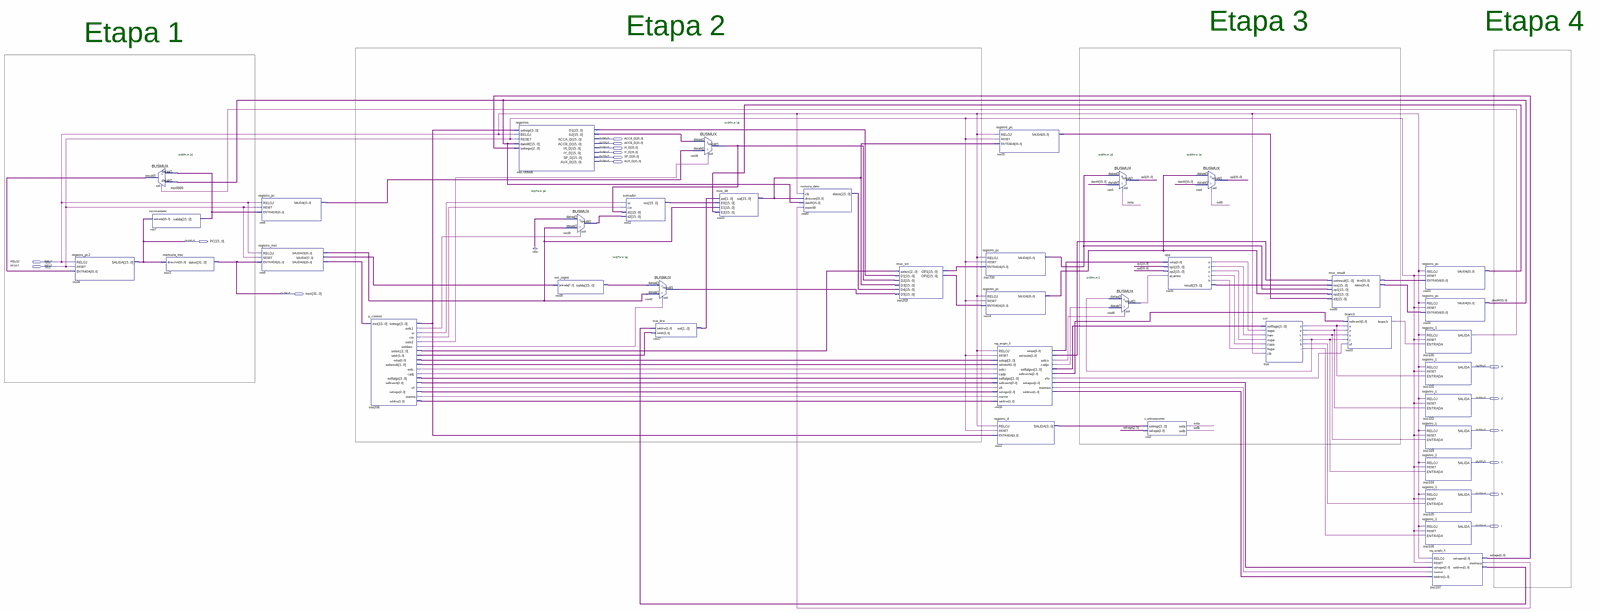
[diagram p0: schematic sheet, whole]
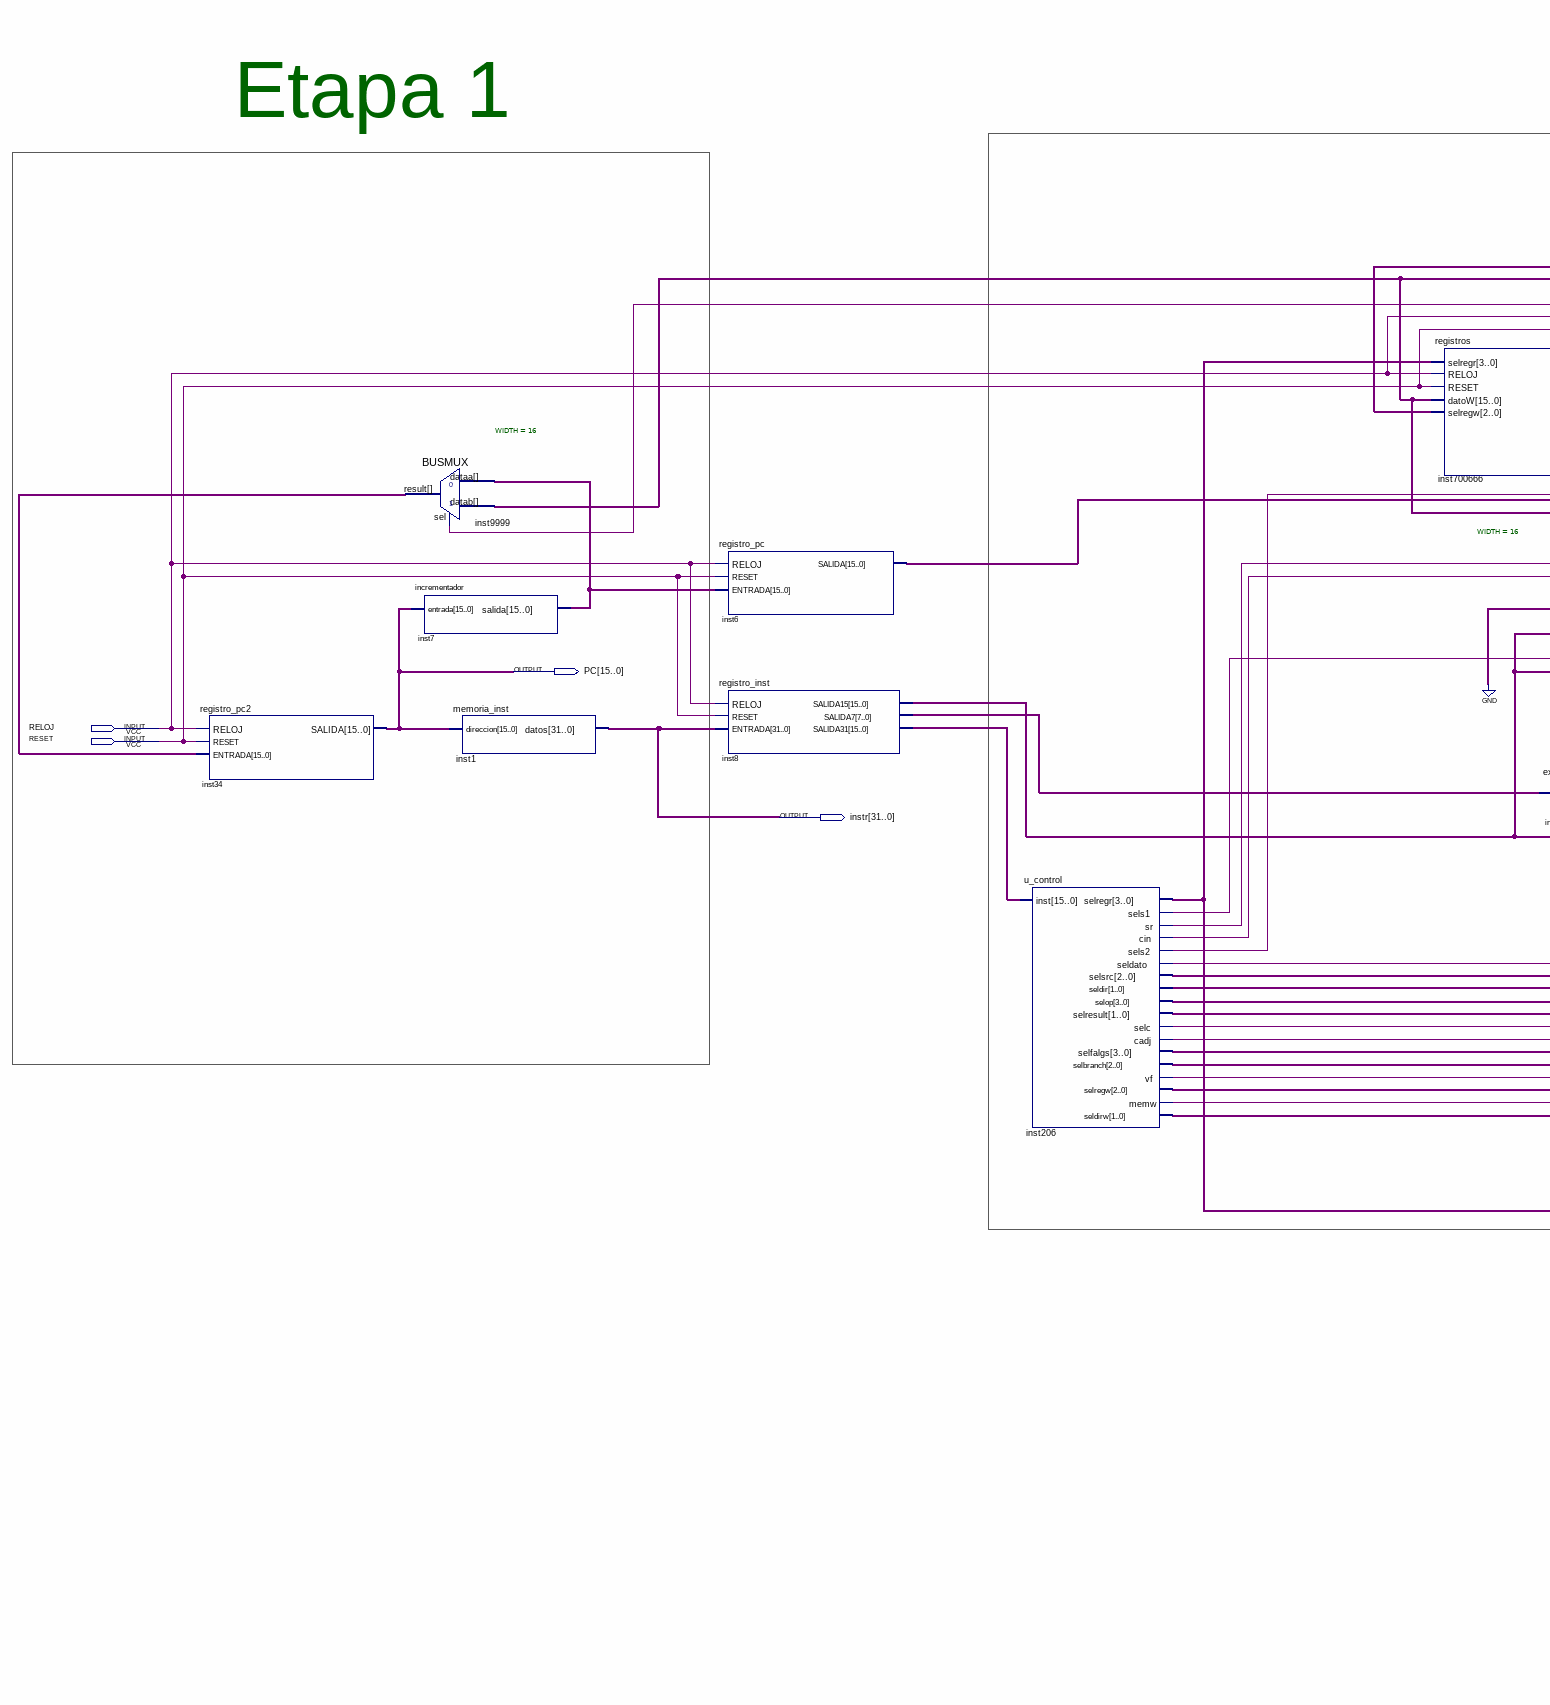
[diagram p1: schematic sheet, left part]
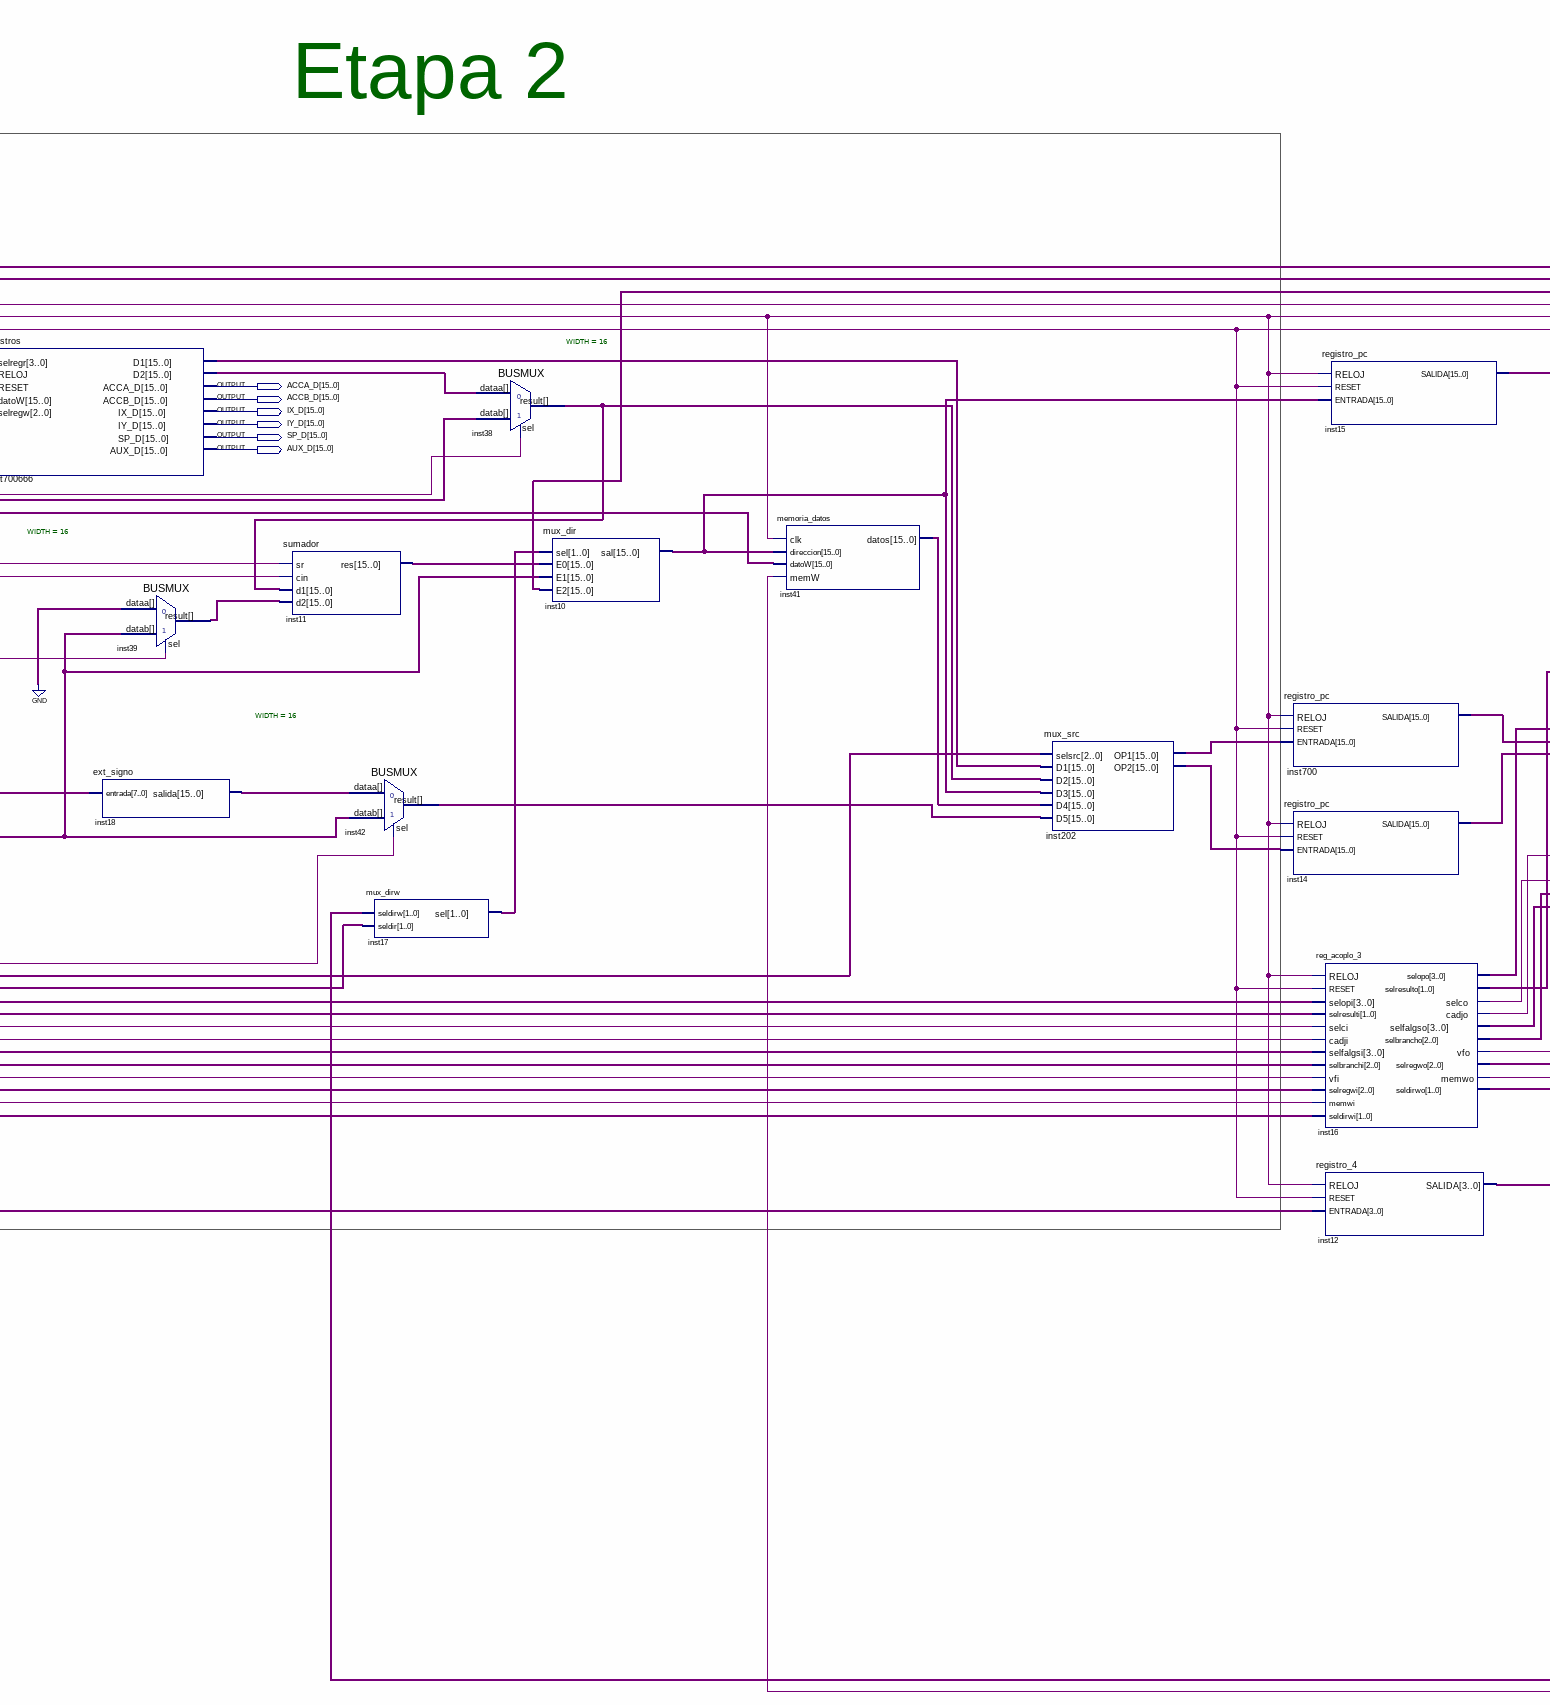
[diagram p2: schematic sheet, centre part]
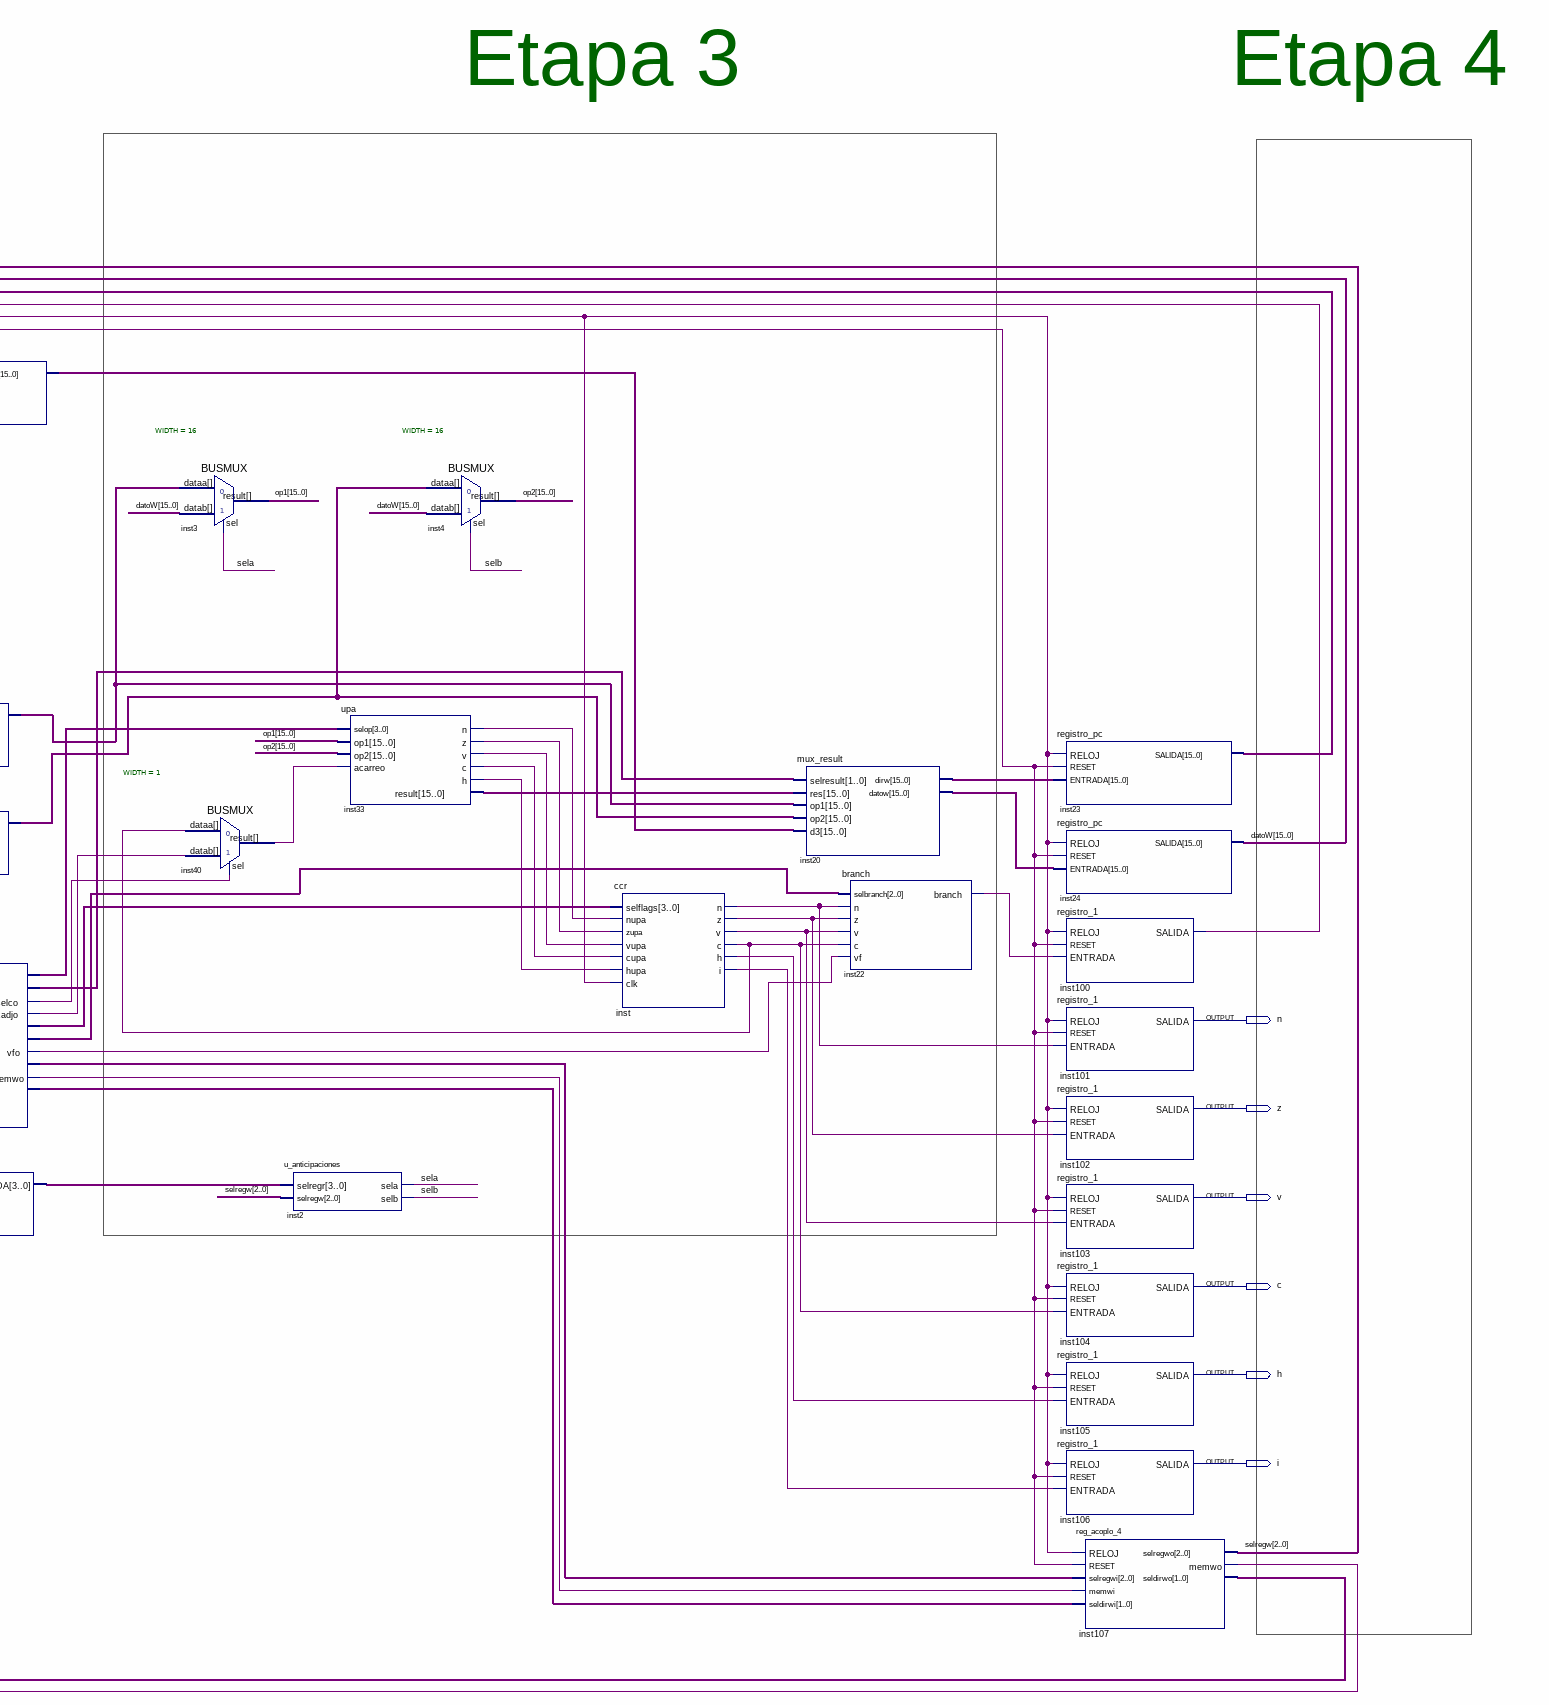
[diagram p3: schematic sheet, right part]
// Quartus schematic pipeline.bdf as structural Verilog: 40 symbols, 16 pins
module pipeline (
  input  RELOJ,
  input  RESET,
  output [15:0] ACCA_D,
  output [15:0] ACCB_D,
  output [15:0] IX_D,
  output [15:0] IY_D,
  output [15:0] SP_D,
  output [15:0] AUX_D,
  output [15:0] PC,
  output [31:0] instr,
  output n,
  output z,
  output v,
  output c,
  output h,
  output i
);

  wire inst16_cadjo, inst16_memwo, inst16_selco, inst16_vfo, inst22_branch, inst33_c, inst33_h, inst33_n,
       inst33_v, inst33_z, inst40_result, inst100_salida, inst107_memwo, inst206_cadj, inst206_cin,
       inst206_memw, inst206_selc, inst206_seldato, inst206_sels1, inst206_sels2, inst206_sr, inst206_vf,
       inst_c, inst_h, inst_i, inst_n, inst_v, inst_z, sela, selb;
  wire [1:0] inst16_seldirwo, inst16_selresulto, inst17_sel, inst107_seldirwo, inst206_seldir,
       inst206_seldirw, inst206_selresult;
  wire [2:0] inst16_selbrancho, inst16_selregwo, inst206_selbranch, inst206_selregw, inst206_selsrc, selregw;
  wire [3:0] inst12_salida, inst16_selfalgso, inst16_selopo, inst206_selfalgs, inst206_selop, inst206_selregr;
  wire [7:0] inst8_salida7;
  wire [15:0] datoW, inst6_salida, inst7_salida, inst8_salida15, inst8_salida31, inst10_sal, inst11_res,
       inst14_salida, inst15_salida, inst18_salida, inst20_datow, inst20_dirw, inst23_salida, inst33_result,
       inst38_result, inst39_result, inst41_datos, inst42_result, inst202_op1, inst202_op2, inst700_salida,
       inst9999_result, inst700666_d1, inst700666_d2, op1, op2;

  registro_pc2 inst34 (.RELOJ(RELOJ), .RESET(RESET), .ENTRADA(inst9999_result), .SALIDA(PC));
  BUSMUX #(.WIDTH(16)) inst9999 (.datab(datoW), .sel(inst100_salida), .dataa(inst7_salida), .result(inst9999_result));
  incrementador inst7 (.entrada(PC), .salida(inst7_salida));
  memoria_inst inst1 (.direccion(PC), .datos(instr));
  registro_pc inst6 (.RELOJ(RELOJ), .RESET(RESET), .ENTRADA(inst7_salida), .SALIDA(inst6_salida));
  registro_inst inst8 (
    .RELOJ(RELOJ), .RESET(RESET), .ENTRADA(instr), .SALIDA15(inst8_salida15), .SALIDA7(inst8_salida7),
    .SALIDA31(inst8_salida31));
  u_control inst206 (
    .inst(inst8_salida31), .selregr(inst206_selregr), .sels1(inst206_sels1), .sr(inst206_sr),
    .cin(inst206_cin), .sels2(inst206_sels2), .seldato(inst206_seldato), .selsrc(inst206_selsrc),
    .seldir(inst206_seldir), .selop(inst206_selop), .selresult(inst206_selresult), .selc(inst206_selc),
    .cadj(inst206_cadj), .selfalgs(inst206_selfalgs), .selbranch(inst206_selbranch), .vf(inst206_vf),
    .selregw(inst206_selregw), .memw(inst206_memw), .seldirw(inst206_seldirw));
  registros inst700666 (
    .selregr(inst206_selregr), .RELOJ(RELOJ), .RESET(RESET), .datoW(datoW), .selregw(selregw),
    .D1(inst700666_d1), .D2(inst700666_d2), .ACCA_D(ACCA_D), .ACCB_D(ACCB_D), .IX_D(IX_D), .IY_D(IY_D),
    .SP_D(SP_D), .AUX_D(AUX_D));
  ext_signo inst18 (.entrada(inst8_salida7), .salida(inst18_salida));
  BUSMUX #(.WIDTH(16)) inst39 (.datab(inst8_salida15), .sel(inst206_sels1), .dataa({16{1'b0}}), .result(inst39_result));
  sumador inst11 (.sr(inst206_sr), .cin(inst206_cin), .d1(inst38_result), .d2(inst39_result), .res(inst11_res));
  BUSMUX #(.WIDTH(16)) inst42 (
    .datab(inst8_salida15), .sel(inst206_seldato), .dataa(inst18_salida), .result(inst42_result));
  mux_dirw inst17 (.seldirw(inst107_seldirwo), .seldir(inst206_seldir), .sel(inst17_sel));
  BUSMUX #(.WIDTH(16)) inst38 (
    .datab(inst6_salida), .sel(inst206_sels2), .dataa(inst700666_d2), .result(inst38_result));
  mux_dir inst10 (.sel(inst17_sel), .E0(inst11_res), .E1(inst8_salida15), .E2(inst23_salida), .sal(inst10_sal));
  memoria_datos inst41 (.clk(RELOJ), .direccion(inst10_sal), .datoW(datoW), .memW(inst107_memwo), .datos(inst41_datos));
  mux_src inst202 (
    .selsrc(inst206_selsrc), .D1(inst700666_d1), .D2(inst38_result), .D3(inst10_sal), .D4(inst41_datos),
    .D5(inst42_result), .OP1(inst202_op1), .OP2(inst202_op2));
  registro_pc inst700 (.RELOJ(RELOJ), .RESET(RESET), .ENTRADA(inst202_op1), .SALIDA(inst700_salida));
  registro_pc inst14 (.RELOJ(RELOJ), .RESET(RESET), .ENTRADA(inst202_op2), .SALIDA(inst14_salida));
  registro_pc inst15 (.RELOJ(RELOJ), .RESET(RESET), .ENTRADA(inst10_sal), .SALIDA(inst15_salida));
  reg_acoplo_3 inst16 (
    .RELOJ(RELOJ), .RESET(RESET), .selopi(inst206_selop), .selresulti(inst206_selresult),
    .selci(inst206_selc), .cadji(inst206_cadj), .selfalgsi(inst206_selfalgs), .selbranchi(inst206_selbranch),
    .vfi(inst206_vf), .selregwi(inst206_selregw), .memwi(inst206_memw), .seldirwi(inst206_seldirw),
    .selopo(inst16_selopo), .selresulto(inst16_selresulto), .selco(inst16_selco), .cadjo(inst16_cadjo),
    .selfalgso(inst16_selfalgso), .selbrancho(inst16_selbrancho), .vfo(inst16_vfo),
    .selregwo(inst16_selregwo), .memwo(inst16_memwo), .seldirwo(inst16_seldirwo));
  registro_4 inst12 (.RELOJ(RELOJ), .RESET(RESET), .ENTRADA(inst206_selregr), .SALIDA(inst12_salida));
  BUSMUX #(.WIDTH(16)) inst3 (.datab(datoW), .sel(sela), .dataa(inst700_salida), .result(op1));
  BUSMUX #(.WIDTH(1)) inst40 (.datab(inst16_cadjo), .sel(inst16_selco), .dataa(inst_c), .result(inst40_result));
  u_anticipaciones inst2 (.selregr(inst12_salida), .selregw(selregw), .sela(sela), .selb(selb));
  upa inst33 (
    .selop(inst16_selopo), .op1(op1), .op2(op2), .acarreo(inst40_result), .n(inst33_n), .z(inst33_z),
    .v(inst33_v), .c(inst33_c), .h(inst33_h), .result(inst33_result));
  BUSMUX #(.WIDTH(16)) inst4 (.datab(datoW), .sel(selb), .dataa(inst14_salida), .result(op2));
  ccr inst (
    .selflags(inst16_selfalgso), .nupa(inst33_n), .zupa(inst33_z), .vupa(inst33_v), .cupa(inst33_c),
    .hupa(inst33_h), .clk(RELOJ), .n(inst_n), .z(inst_z), .v(inst_v), .c(inst_c), .h(inst_h), .i(inst_i));
  mux_result inst20 (
    .selresult(inst16_selresulto), .res(inst33_result), .op1(inst700_salida), .op2(inst14_salida),
    .d3(inst15_salida), .dirw(inst20_dirw), .datow(inst20_datow));
  branch inst22 (
    .selbranch(inst16_selbrancho), .n(inst_n), .z(inst_z), .v(inst_v), .c(inst_c), .vf(inst16_vfo),
    .branch(inst22_branch));
  registro_pc inst23 (.RELOJ(RELOJ), .RESET(RESET), .ENTRADA(inst20_dirw), .SALIDA(inst23_salida));
  registro_pc inst24 (.RELOJ(RELOJ), .RESET(RESET), .ENTRADA(inst20_datow), .SALIDA(datoW));
  registro_1 inst100 (.RELOJ(RELOJ), .RESET(RESET), .ENTRADA(inst22_branch), .SALIDA(inst100_salida));
  registro_1 inst101 (.RELOJ(RELOJ), .RESET(RESET), .ENTRADA(inst_n), .SALIDA(n));
  registro_1 inst102 (.RELOJ(RELOJ), .RESET(RESET), .ENTRADA(inst_z), .SALIDA(z));
  registro_1 inst103 (.RELOJ(RELOJ), .RESET(RESET), .ENTRADA(inst_v), .SALIDA(v));
  registro_1 inst104 (.RELOJ(RELOJ), .RESET(RESET), .ENTRADA(inst_c), .SALIDA(c));
  registro_1 inst105 (.RELOJ(RELOJ), .RESET(RESET), .ENTRADA(inst_h), .SALIDA(h));
  registro_1 inst106 (.RELOJ(RELOJ), .RESET(RESET), .ENTRADA(inst_i), .SALIDA(i));
  reg_acoplo_4 inst107 (
    .RELOJ(RELOJ), .RESET(RESET), .selregwi(inst16_selregwo), .memwi(inst16_memwo),
    .seldirwi(inst16_seldirwo), .selregwo(selregw), .memwo(inst107_memwo), .seldirwo(inst107_seldirwo));

  // Notes on the sheet:
  //   Etapa 3
  //   Etapa 4
  //   Etapa 2
  //   Etapa 1
endmodule
